# Altium schematic sheet Thermal_Sensor_2.SchDoc
size A
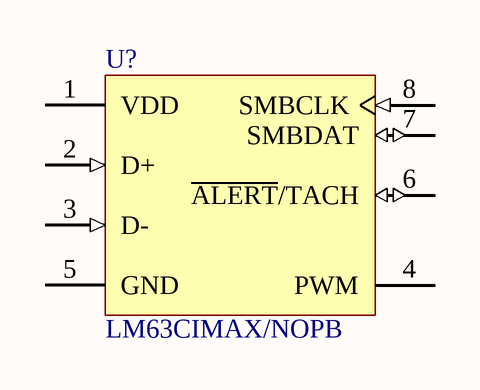
[diagram p0: Thermal_Sensor_2.SchDoc]

## Parts
U?  LM63CIMAX/NOPB  [D0008A_M]

## Nets

Not connected (* = marked no-connect by the designer): U? 1(VDD) 2(D+) 3(D-) 4(PWM) 5(GND) 6(~{ALERT}/TACH) 7(SMBDAT) 8(SMBCLK)

## Library data of the parts
U? = CMP-0066-00098-3: ±1ºC/±3ºC Accurate Remote Diode Digital Temperature Sensor with Integrated Fan Control, 8-pin Narrow SOIC, Pb-Free; Manufacturer: Texas Instruments; CompType: Temp Sensor IC; PowerWise: Y; PackageTopMarking: NSZXTT*LM63*CIMA; PackageDescription: SOIC Narrow, 4.9 x 3.9 x 1.45mm, 8 Lead, 1.27mm Pitch; ComponentLink1Description: Datasheet URL; PinCount: 8; PackageReference: D0008A; Code_JEDEC: MS-012-AA; RoHS: Y; Code_IPC: SOIC127P600-8; ComponentLink1URL: http://www.ti.com/general/docs/lit/getliterature.tsp?genericPartNumber=LM63&fileType=pdf